# Altium schematic sheet 2015-02-06_17-04-491.schdoc
size 359 x 172 mm; SheetNumber: 1; SheetTotal: 1
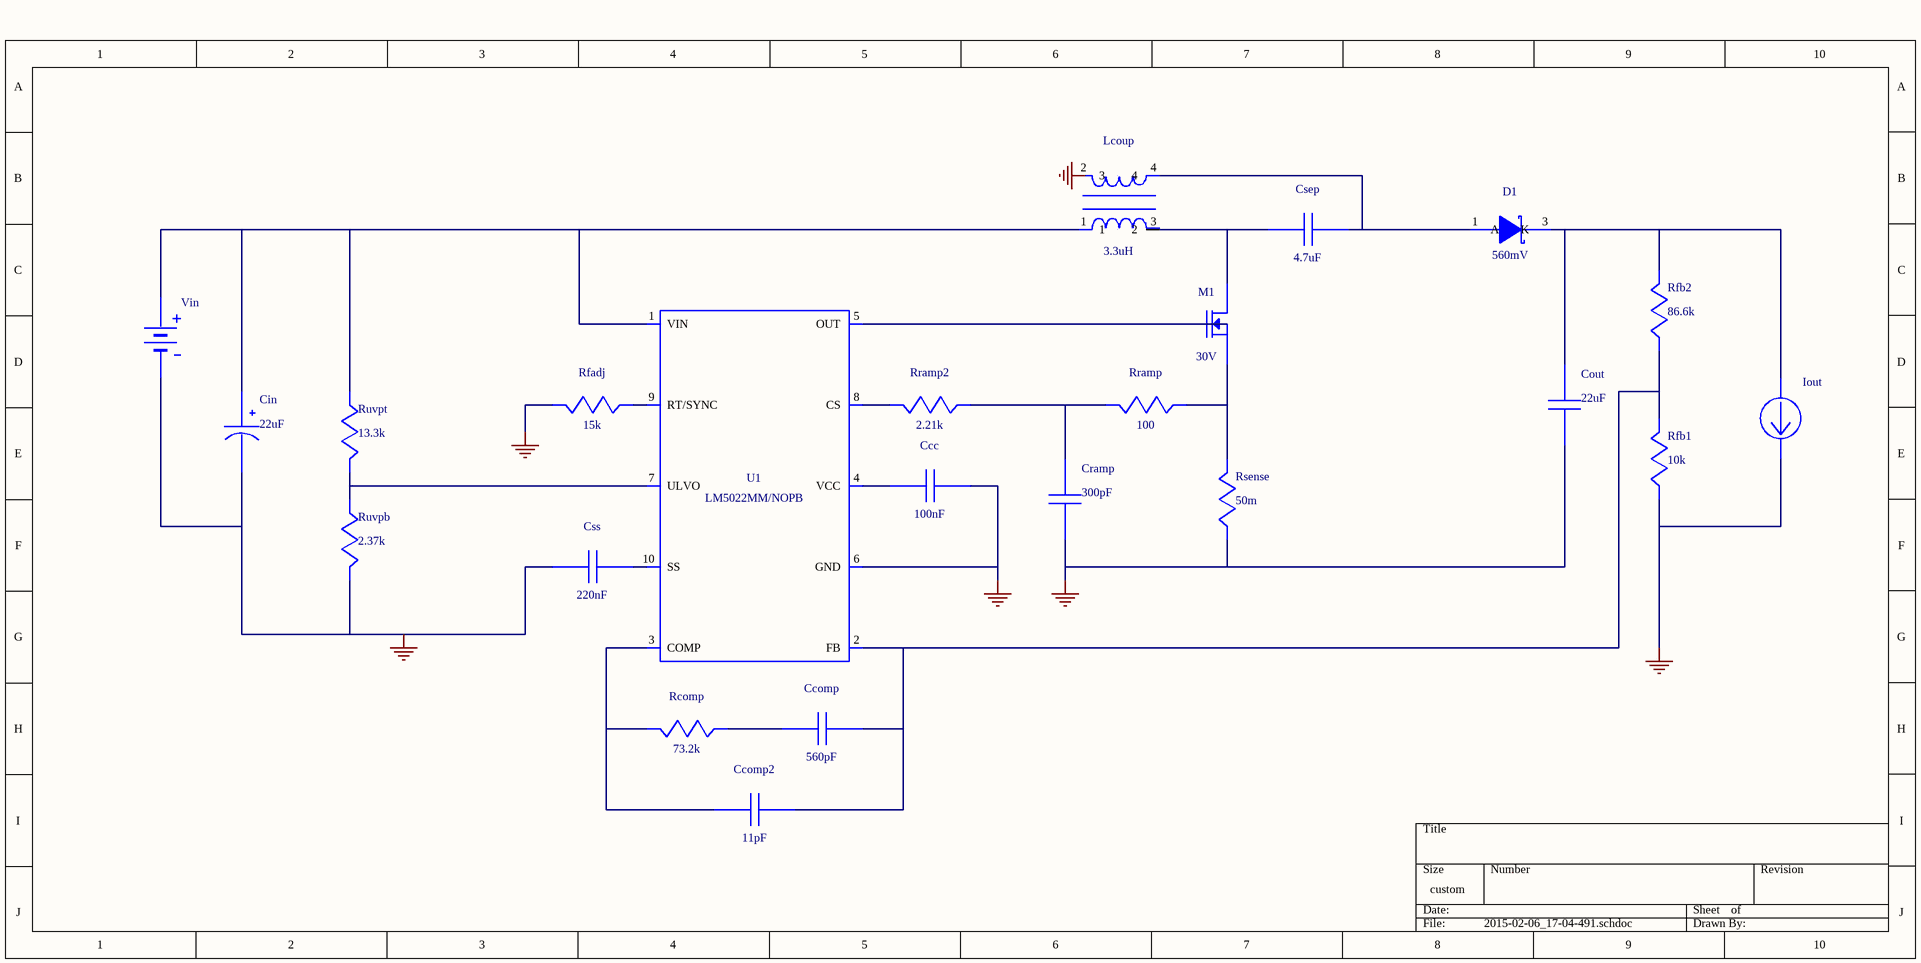
[diagram p0: 2015-02-06_17-04-491.schdoc]

## Parts
Ccc  value 100nF  (hidden comment: GRM155R61C104KA88D)
Ccomp  value 560pF  (hidden comment: CC0805KRX7R9BB561)
Ccomp2  value 11pF  (hidden comment: C0603C0G1E110G)
Cin  value 22uF  (hidden comment: TPSB226K020R0400)
Cout  value 22uF  (hidden comment: GRM32ER61C226KE20L)
Cramp  value 300pF  (hidden comment: GRM1555C1E301JA01D)
Csep  value 4.7uF  (hidden comment: GRM21BR61E475MA12L)
Css  value 220nF  (hidden comment: GRM155R71C224KA12D)
D1  value 560mV  (hidden comment: PDS760-13)
Iout  WB_CURRENT_LOAD  (value not drawn)
Lcoup  value 3.3uH  (hidden comment: DRQ127-3R3-R)
M1  value 30V  (hidden comment: SI2316BDS-T1-E3)
Rcomp  value 73.2k  (hidden comment: CRCW040273K2FKED)
Rfadj  value 15k  (hidden comment: CRCW040215K0FKED)
Rfb1  value 10k  (hidden comment: CRCW040210K0FKED)
Rfb2  value 86.6k  (hidden comment: CRCW040286K6FKED)
Rramp  value 100  (hidden comment: CRCW0402100RFKED)
Rramp2  value 2.21k  (hidden comment: CRCW04022K21FKED)
Rsense  value 50m  (hidden comment: CSRN2010FK50L0)
Ruvpb  value 2.37k  (hidden comment: CRCW04022K37FKED)
Ruvpt  value 13.3k  (hidden comment: CRCW040213K3FKED)
U1  LM5022MM/NOPB
Vin  WB_BATTERY  (value not drawn)

## Nets
0: Ccc.2 Cin.2(-) Cout.2 Cramp.2 Css.2 Iout.2(-) Rfadj.1 Rfb1.2 Rsense.2 Ruvpb.1 U1.6(GND) Vin.2(-)
NetCcc_1: Ccc.1 U1.4(VCC)
NetCcomp2_2: Ccomp2.2 Rcomp.1 U1.3(COMP)
NetCcomp_1: Ccomp.1 Ccomp2.1 Rfb1.1 Rfb2.2 U1.2(FB)
NetCcomp_2: Ccomp.2 Rcomp.2
NetCin_1: Cin.1(+) Lcoup.1 Ruvpt.2 U1.1(VIN) Vin.1(+)
NetCout_1: Cout.1 D1.3(K) Iout.1(+) Rfb2.1
NetCramp_1: Cramp.1 Rramp.1 Rramp2.2
NetCsep_1: Csep.1 D1.1(A) D1.2(A) Lcoup.4
NetCsep_2: Csep.2 Lcoup.3(2) M1.3(Drain)
NetCss_1: Css.1 U1.10(SS)
NetM1_1: M1.1(Gate) U1.5(OUT)
NetM1_2: M1.2(Source) Rramp.2 Rsense.1
NetRfadj_2: Rfadj.2 U1.9(RT/SYNC)
NetRramp2_1: Rramp2.1 U1.8(CS)
NetRuvpb_2: Ruvpb.2 Ruvpt.1 U1.7(ULVO)

Not connected (* = marked no-connect by the designer): Lcoup 2(3)

## Notes on the sheet
- Labels drawn without touching a wire or pin: 0

## Library data of the parts
Ccc = GRM155R61C104KA88D: GRM155R61C104KA8; Manufacturer Name: MuRata; PackageReference: GRM155R61C104KA88D; Manufacturer Part Number: GRM155R61C104KA88D
Ccomp = CC0805KRX7R9BB561: CC0805KRX7R9BB56; Manufacturer Name: Yageo America; PackageReference: CC0805KRX7R9BB561; Manufacturer Part Number: CC0805KRX7R9BB561
Ccomp2 = C0603C0G1E110G: Manufacturer Name: TDK; PackageReference: C0603C0G1E110G; Manufacturer Part Number: C0603C0G1E110G
Cin = TPSB226K020R0400: Manufacturer Name: AVX; PackageReference: TPSB226K020R0400; Manufacturer Part Number: TPSB226K020R0400
Cout = GRM32ER61C226KE20L: GRM32ER61C226KE2; Manufacturer Name: MuRata; PackageReference: GRM32ER61C226KE20L; Manufacturer Part Number: GRM32ER61C226KE20L
Cramp = GRM1555C1E301JA01D: GRM1555C1E301JA0; Manufacturer Name: MuRata; PackageReference: GRM1555C1E301JA01D; Manufacturer Part Number: GRM1555C1E301JA01D
Csep = GRM21BR61E475MA12L: GRM21BR61E475MA1; Manufacturer Name: MuRata; PackageReference: GRM21BR61E475MA12L; Manufacturer Part Number: GRM21BR61E475MA12L
Css = GRM155R71C224KA12D: GRM155R71C224KA1; Manufacturer Name: MuRata; PackageReference: GRM155R71C224KA12D; Manufacturer Part Number: GRM155R71C224KA12D
D1 = PDS760-13: Manufacturer Name: Diodes Inc.; PackageReference: PDS760-13; Manufacturer Part Number: PDS760-13
Iout = WB_CURRENT_LOAD: Value: UNLISTED; PackageReference: WB_CURRENT_LOAD; Manufacturer Part Number: WB_CURRENT_LOAD; Manufacturer Name: WB_CURRENT_LOAD
Lcoup = DRQ127-3R3-R: Manufacturer Name: Coiltronics; PackageReference: DRQ127-3R3-R; Manufacturer Part Number: DRQ127-3R3-R
M1 = SI2316BDS-T1-E3: Manufacturer Name: Vishay-Siliconix; PackageReference: SI2316BDS-T1-E3; Manufacturer Part Number: SI2316BDS-T1-E3
Rcomp = CRCW040273K2FKED: Manufacturer Name: Vishay-Dale; PackageReference: CRCW040273K2FKED; Manufacturer Part Number: CRCW040273K2FKED
Rfadj = CRCW040215K0FKED: Manufacturer Name: Vishay-Dale; PackageReference: CRCW040215K0FKED; Manufacturer Part Number: CRCW040215K0FKED
Rfb1 = CRCW040210K0FKED: Manufacturer Name: Vishay-Dale; PackageReference: CRCW040210K0FKED; Manufacturer Part Number: CRCW040210K0FKED
Rfb2 = CRCW040286K6FKED: Manufacturer Name: Vishay-Dale; PackageReference: CRCW040286K6FKED; Manufacturer Part Number: CRCW040286K6FKED
Rramp = CRCW0402100RFKED: Manufacturer Name: Vishay-Dale; PackageReference: CRCW0402100RFKED; Manufacturer Part Number: CRCW0402100RFKED
Rramp2 = CRCW04022K21FKED: Manufacturer Name: Vishay-Dale; PackageReference: CRCW04022K21FKED; Manufacturer Part Number: CRCW04022K21FKED
Rsense = CSRN2010FK50L0: Manufacturer Name: Stackpole Electronics Inc; PackageReference: CSRN2010FK50L0; Manufacturer Part Number: CSRN2010FK50L0
Ruvpb = CRCW04022K37FKED: Manufacturer Name: Vishay-Dale; PackageReference: CRCW04022K37FKED; Manufacturer Part Number: CRCW04022K37FKED
Ruvpt = CRCW040213K3FKED: Manufacturer Name: Vishay-Dale; PackageReference: CRCW040213K3FKED; Manufacturer Part Number: CRCW040213K3FKED
U1 = LM5022MM/NOPB: Manufacturer Name: Texas Instruments; Value: UNLISTED; PackageReference: LM5022MM/NOPB; Manufacturer Part Number: LM5022MM/NOPB
Vin = WB_BATTERY: Value: UNLISTED; PackageReference: WB_BATTERY; Manufacturer Part Number: WB_BATTERY; Manufacturer Name: WB_BATTERY